# EasyEDA Pro project CALU_BMS_1_2_0_0.epro, board PCB5
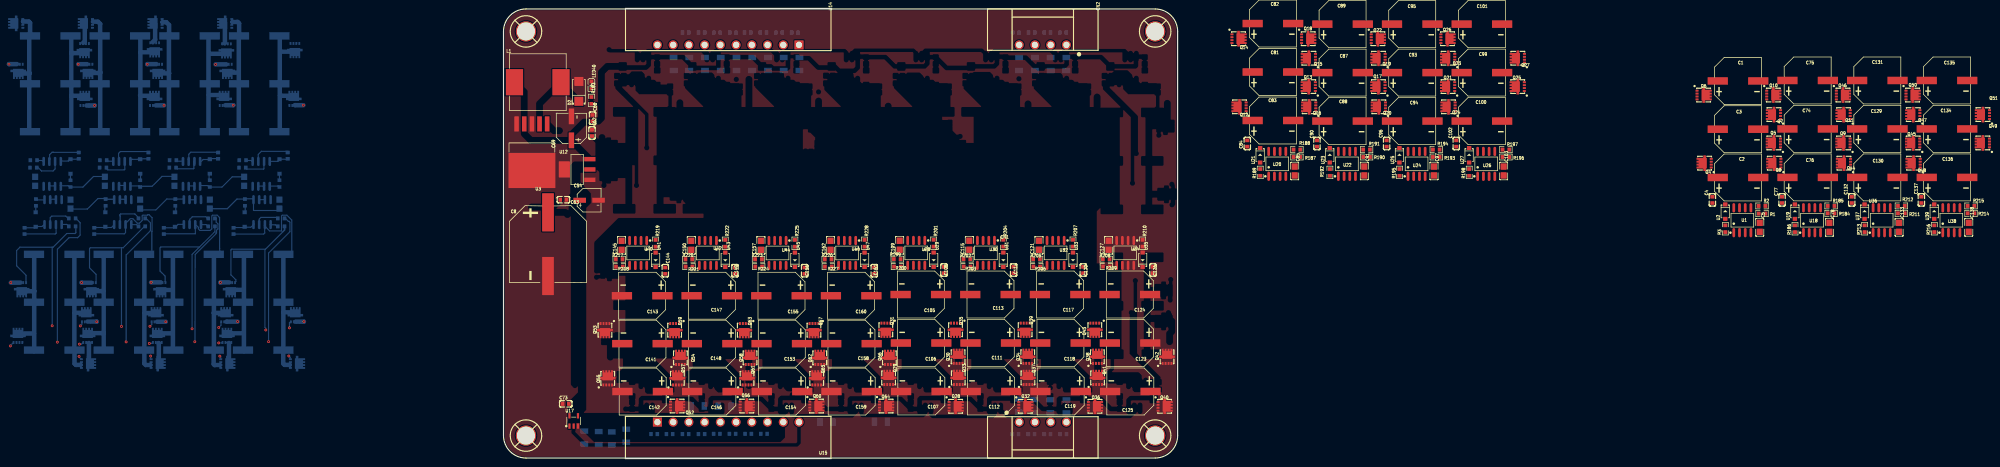
[diagram p12: board, top side]
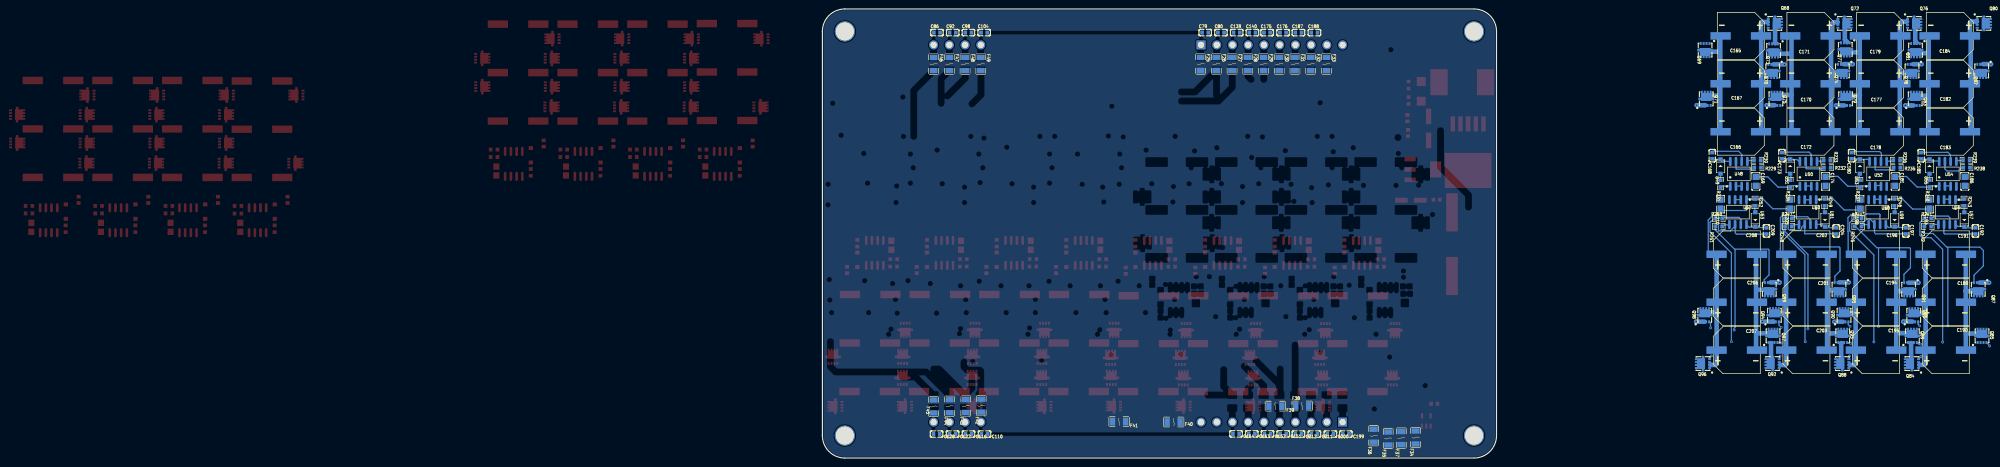
[diagram p13: board, bottom side, seen from below]

Outline 150 x 100 mm; copper layers: Top Layer, Inner1, Inner2, Bottom Layer. Coordinates in mm from the lower left corner of the outline.
Outline path: 0,95 0,5 arc(1.46,1.46) 5,0 145,0 arc(148.54,1.46) 150,5 150,95 arc(148.54,98.54) 145,100 5,100 arc(1.46,98.54) 0,95
Stack: Top Layer 0.035mm Outer layer thickness 1oz / Dielectric1 0.2104mm 7628 RC49% 8.6mil / Inner1 0.0152mm Inner layer thickness / Dielectric2 1.065mm 1.1mm H/HOZ Copper / Inner2 0.0152mm Inner layer thickness / Dielectric3 0.2104mm 7628 RC49% 8.6mil / Bottom Layer 0.035mm Outer layer thickness 1oz

## Design rules (mm)
template: Custom Config
spacing copperThickness1oz (default): track to track 0.102, other pairs 0.152 to 0.3
spacing copperThickness2oz: track to track 0.203, other pairs 0.152 to 0.3
track width copperThickness1oz (default): min 0.127, default 0.254, max 2.54
track width copperThickness2oz: min 0.203, default 0.254, max 2.54
differential pair differentialPair (default): width min 0.127, default 0.254, max 2.54; gap min 0.152, default 0.152
via viaSize (default): diameter min 0.5, default 0.61, max 10; hole min 0.3, default 0.305, max 6.3

## Placement (name value [footprint] x y rotation side)
C1  2200uF  [CAP-SMD_BD10.0-L10.3-W10.3-LS11.0-FD]  274.69 83.97 0 top
C2  2200uF  [CAP-SMD_BD10.0-L10.3-W10.3-LS11.0-FD]  274.69 62.48 0 top
C3  2200uF  [CAP-SMD_BD10.0-L10.3-W10.3-LS11.0-FD]  274.69 73.22 0 top
C4  470nF  [C0603]  268.99 57.49 90 top
C5  10uF  [C0805]  279.53 51.37 270 top
C8  470uF  [CAP-SMD_BD16.0-L17.0-W17.0-FD-LS18.0]  9.91 47.62 270 top
C54  22uF  [CAP-SMD_BD5.0-L5.3-W5.3-LS6.0-FD]  19.05 57.4 0 top
C62  100nF  [C0603]  19.69 72.39 270 top
C63  100nF  [C0603]  13.33 57.53 180 top
C68  100nF  [C0603]  19.81 75.69 270 top
C69  470uF  [CAP-SMD_BD6.3-L6.6-W6.6-LS7.6-RD]  15.11 73.41 90 top
C73  100nF  [C0603]  13.84 12.06 0 top
C74  2200uF  [CAP-SMD_BD10.0-L10.3-W10.3-LS11.0-FD]  290.19 73.28 0 top
C75  2200uF  [CAP-SMD_BD10.0-L10.3-W10.3-LS11.0-FD]  290.19 84.08 0 top
C76  2200uF  [CAP-SMD_BD10.0-L10.3-W10.3-LS11.0-FD]  290.19 62.49 0 top
C77  470nF  [C0603]  284.49 57.49 90 top
C78  10uF  [C0805]  295.03 51.37 270 top
C79  100nF  [C0603]  64.81 94.75 180 bottom
C80  100nF  [C0603]  61.31 94.75 180 bottom
C81  2200uF  [CAP-SMD_BD10.0-L10.3-W10.3-LS11.0-FD]  171.2 85.96 0 top
C82  2200uF  [CAP-SMD_BD10.0-L10.3-W10.3-LS11.0-FD]  171.2 96.75 0 top
C83  2200uF  [CAP-SMD_BD10.0-L10.3-W10.3-LS11.0-FD]  171.2 75.17 0 top
C84  470nF  [C0603]  165.5 70.04 90 top
C85  10uF  [C0805]  176.04 63.92 270 top
C86  100nF  [C0603]  124.5 94.75 180 bottom
C87  2200uF  [CAP-SMD_BD10.0-L10.3-W10.3-LS11.0-FD]  186.7 85.83 0 top
C88  2200uF  [CAP-SMD_BD10.0-L10.3-W10.3-LS11.0-FD]  186.7 75.04 0 top
C89  2200uF  [CAP-SMD_BD10.0-L10.3-W10.3-LS11.0-FD]  186.7 96.63 0 top
C90  470nF  [C0603]  181 70.04 90 top
C91  10uF  [C0805]  191.54 63.92 270 top
C92  100nF  [C0603]  121 94.75 180 bottom
C93  2200uF  [CAP-SMD_BD10.0-L10.3-W10.3-LS11.0-FD]  202.2 85.83 0 top
C94  2200uF  [CAP-SMD_BD10.0-L10.3-W10.3-LS11.0-FD]  202.2 75.04 0 top
C95  2200uF  [CAP-SMD_BD10.0-L10.3-W10.3-LS11.0-FD]  202.2 96.63 0 top
C96  470nF  [C0603]  196.5 70.04 90 top
C97  10uF  [C0805]  207.04 63.92 270 top
C98  100nF  [C0603]  117.5 94.75 180 bottom
C99  2200uF  [CAP-SMD_BD10.0-L10.3-W10.3-LS11.0-FD]  217.7 85.83 0 top
C100  2200uF  [CAP-SMD_BD10.0-L10.3-W10.3-LS11.0-FD]  217.7 75.04 0 top
C101  2200uF  [CAP-SMD_BD10.0-L10.3-W10.3-LS11.0-FD]  217.7 96.63 0 top
C102  470nF  [C0603]  212 70.04 90 top
C103  10uF  [C0805]  222.54 63.92 270 top
C104  100nF  [C0603]  114 94.75 180 bottom
C105  2200uF  [CAP-SMD_BD10.0-L10.3-W10.3-LS11.0-FD]  92.86 36.41 180 top
C106  2200uF  [CAP-SMD_BD10.0-L10.3-W10.3-LS11.0-FD]  92.92 25.61 180 top
C107  2200uF  [CAP-SMD_BD10.0-L10.3-W10.3-LS11.0-FD]  92.97 14.82 180 top
C108  470nF  [C0603]  98 41.87 270 top
C109  10uF  [C0805]  88.15 47.38 90 top
C110  100nF  [C0603]  113.92 5.33 0 bottom
C111  2200uF  [CAP-SMD_BD10.0-L10.3-W10.3-LS11.0-FD]  108.42 25.61 180 top
C112  2200uF  [CAP-SMD_BD10.0-L10.3-W10.3-LS11.0-FD]  108.47 14.82 180 top
C113  2200uF  [CAP-SMD_BD10.0-L10.3-W10.3-LS11.0-FD]  108.36 36.41 180 top
C114  470nF  [C0603]  113.5 41.87 270 top
C115  10uF  [C0805]  103.65 47.38 90 top
C116  100nF  [C0603]  117.47 5.33 0 bottom
C117  2200uF  [CAP-SMD_BD10.0-L10.3-W10.3-LS11.0-FD]  123.86 36.41 180 top
C118  2200uF  [CAP-SMD_BD10.0-L10.3-W10.3-LS11.0-FD]  123.92 25.61 180 top
C119  2200uF  [CAP-SMD_BD10.0-L10.3-W10.3-LS11.0-FD]  123.97 14.82 180 top
C120  470nF  [C0603]  129 41.87 270 top
C121  10uF  [C0805]  119.15 47.38 90 top
C122  100nF  [C0603]  121.03 5.33 0 bottom
C123  2200uF  [CAP-SMD_BD10.0-L10.3-W10.3-LS11.0-FD]  139.42 25.61 180 top
C124  2200uF  [CAP-SMD_BD10.0-L10.3-W10.3-LS11.0-FD]  139.36 36.41 180 top
C125  2200uF  [CAP-SMD_BD10.0-L10.3-W10.3-LS11.0-FD]  139.47 14.82 180 top
C126  470nF  [C0603]  144.5 41.87 270 top
C127  10uF  [C0805]  134.65 47.38 90 top
C128  100nF  [C0603]  124.59 5.33 0 bottom
C129  2200uF  [CAP-SMD_BD10.0-L10.3-W10.3-LS11.0-FD]  305.69 73.28 0 top
C130  2200uF  [CAP-SMD_BD10.0-L10.3-W10.3-LS11.0-FD]  305.69 62.49 0 top
C131  2200uF  [CAP-SMD_BD10.0-L10.3-W10.3-LS11.0-FD]  305.69 84.08 0 top
C132  470nF  [C0603]  299.99 57.49 90 top
C133  10uF  [C0805]  310.53 51.37 270 top
C134  2200uF  [CAP-SMD_BD10.0-L10.3-W10.3-LS11.0-FD]  321.19 73.28 0 top
C135  2200uF  [CAP-SMD_BD10.0-L10.3-W10.3-LS11.0-FD]  321.19 84.08 0 top
C136  2200uF  [CAP-SMD_BD10.0-L10.3-W10.3-LS11.0-FD]  321.19 62.49 0 top
C137  470nF  [C0603]  315.49 57.49 90 top
C138  10uF  [C0805]  326.03 51.37 270 top
C139  100nF  [C0603]  57.81 94.75 180 bottom
C140  100nF  [C0603]  54.31 94.75 180 bottom
C141  2200uF  [CAP-SMD_BD10.0-L10.3-W10.3-LS11.0-FD]  30.92 25.47 180 top
C142  2200uF  [CAP-SMD_BD10.0-L10.3-W10.3-LS11.0-FD]  30.97 14.8 180 top
C143  2200uF  [CAP-SMD_BD10.0-L10.3-W10.3-LS11.0-FD]  30.86 36.14 180 top
C144  470nF  [C0603]  36 41.72 270 top
C145  10uF  [C0805]  26.27 47.36 90 top
C146  2200uF  [CAP-SMD_BD10.0-L10.3-W10.3-LS11.0-FD]  46.47 14.8 180 top
C147  2200uF  [CAP-SMD_BD10.0-L10.3-W10.3-LS11.0-FD]  46.36 36.14 180 top
C148  2200uF  [CAP-SMD_BD10.0-L10.3-W10.3-LS11.0-FD]  46.42 25.47 180 top
C149  470nF  [C0603]  51.5 41.72 270 top
C150  10uF  [C0805]  41.77 47.36 90 top
C151  100nF  [C0603]  47.45 5.38 0 bottom
C152  100nF  [C0603]  50.95 5.38 0 bottom
C153  2200uF  [CAP-SMD_BD10.0-L10.3-W10.3-LS11.0-FD]  61.92 25.47 180 top
C154  2200uF  [CAP-SMD_BD10.0-L10.3-W10.3-LS11.0-FD]  61.97 14.8 180 top
C155  2200uF  [CAP-SMD_BD10.0-L10.3-W10.3-LS11.0-FD]  61.86 36.14 180 top
C156  470nF  [C0603]  67 41.72 270 top
C157  10uF  [C0805]  57.27 47.36 90 top
C158  2200uF  [CAP-SMD_BD10.0-L10.3-W10.3-LS11.0-FD]  77.42 25.47 180 top
C159  2200uF  [CAP-SMD_BD10.0-L10.3-W10.3-LS11.0-FD]  77.47 14.8 180 top
C160  2200uF  [CAP-SMD_BD10.0-L10.3-W10.3-LS11.0-FD]  77.36 36.14 180 top
C161  470nF  [C0603]  82.5 41.72 270 top
C162  10uF  [C0805]  72.77 47.36 90 top
C163  100nF  [C0603]  54.45 5.38 0 bottom
C164  100nF  [C0603]  57.95 5.38 0 bottom
C165  2200uF  [CAP-SMD_BD10.0-L10.3-W10.3-LS11.0-FD]  -54.36 94.01 0 bottom
C166  2200uF  [CAP-SMD_BD10.0-L10.3-W10.3-LS11.0-FD]  -54.36 72.67 0 bottom
C167  2200uF  [CAP-SMD_BD10.0-L10.3-W10.3-LS11.0-FD]  -54.36 83.34 0 bottom
C168  470nF  [C0603]  -48.01 67.34 90 bottom
C169  10uF  [C0805]  -57.71 61.62 270 bottom
C170  2200uF  [CAP-SMD_BD10.0-L10.3-W10.3-LS11.0-FD]  -69.86 83.34 0 bottom
C171  2200uF  [CAP-SMD_BD10.0-L10.3-W10.3-LS11.0-FD]  -69.86 94.01 0 bottom
C172  2200uF  [CAP-SMD_BD10.0-L10.3-W10.3-LS11.0-FD]  -69.86 72.67 0 bottom
C173  470nF  [C0603]  -63.51 67.34 90 bottom
C174  10uF  [C0805]  -73.21 61.62 270 bottom
C175  100nF  [C0603]  51.05 94.74 180 bottom
C176  100nF  [C0603]  47.5 94.74 180 bottom
C177  2200uF  [CAP-SMD_BD10.0-L10.3-W10.3-LS11.0-FD]  -85.36 83.34 0 bottom
C178  2200uF  [CAP-SMD_BD10.0-L10.3-W10.3-LS11.0-FD]  -85.36 72.67 0 bottom
C179  2200uF  [CAP-SMD_BD10.0-L10.3-W10.3-LS11.0-FD]  -85.36 94.01 0 bottom
C180  470nF  [C0603]  -79.01 67.34 90 bottom
C181  10uF  [C0805]  -88.71 61.62 270 bottom
C182  2200uF  [CAP-SMD_BD10.0-L10.3-W10.3-LS11.0-FD]  -100.86 83.34 0 bottom
C183  2200uF  [CAP-SMD_BD10.0-L10.3-W10.3-LS11.0-FD]  -100.86 72.67 0 bottom
C184  2200uF  [CAP-SMD_BD10.0-L10.3-W10.3-LS11.0-FD]  -100.86 94.01 0 bottom
C185  470nF  [C0603]  -94.51 67.34 90 bottom
C186  10uF  [C0805]  -104.21 61.62 270 bottom
C187  100nF  [C0603]  44.07 94.74 180 bottom
C188  100nF  [C0603]  40.51 94.74 180 bottom
C189  2200uF  [CAP-SMD_BD10.0-L10.3-W10.3-LS11.0-FD]  -99.97 34.7 180 bottom
C190  2200uF  [CAP-SMD_BD10.0-L10.3-W10.3-LS11.0-FD]  -99.97 24.03 180 bottom
C191  2200uF  [CAP-SMD_BD10.0-L10.3-W10.3-LS11.0-FD]  -99.97 45.37 180 bottom
C192  470nF  [C0603]  -106.57 50.57 270 bottom
C193  10uF  [C0805]  -96.35 56.54 90 bottom
C194  2200uF  [CAP-SMD_BD10.0-L10.3-W10.3-LS11.0-FD]  -84.47 34.7 180 bottom
C195  2200uF  [CAP-SMD_BD10.0-L10.3-W10.3-LS11.0-FD]  -84.47 24.03 180 bottom
C196  2200uF  [CAP-SMD_BD10.0-L10.3-W10.3-LS11.0-FD]  -84.47 45.37 180 bottom
C197  470nF  [C0603]  -91.07 50.57 270 bottom
C198  10uF  [C0805]  -80.85 56.54 90 bottom
C199  100nF  [C0603]  33.53 5.33 0 bottom
C200  100nF  [C0603]  36.96 5.33 0 bottom
C201  2200uF  [CAP-SMD_BD10.0-L10.3-W10.3-LS11.0-FD]  -68.97 34.7 180 bottom
C202  2200uF  [CAP-SMD_BD10.0-L10.3-W10.3-LS11.0-FD]  -68.97 45.37 180 bottom
C203  2200uF  [CAP-SMD_BD10.0-L10.3-W10.3-LS11.0-FD]  -68.97 24.03 180 bottom
C204  470nF  [C0603]  -75.57 50.57 270 bottom
C205  10uF  [C0805]  -65.35 56.54 90 bottom
C206  2200uF  [CAP-SMD_BD10.0-L10.3-W10.3-LS11.0-FD]  -53.47 34.7 180 bottom
C207  2200uF  [CAP-SMD_BD10.0-L10.3-W10.3-LS11.0-FD]  -53.47 24.03 180 bottom
C208  2200uF  [CAP-SMD_BD10.0-L10.3-W10.3-LS11.0-FD]  -53.47 45.37 180 bottom
C209  470nF  [C0603]  -60.07 50.57 270 bottom
C210  10uF  [C0805]  -49.85 56.54 90 bottom
C211  100nF  [C0603]  40.51 5.33 0 bottom
C212  100nF  [C0603]  44.07 5.33 0 bottom
CN1  BATT_NEXT  [CONN-TH_4P-P3.50_MAX_MX15EDGRM-3.5-04P-GN01-CU-A]  120 8 0 top
CN2  BATT_PREV  [CONN-TH_4P-P3.50_MAX_MX15EDGRM-3.5-04P-GN01-CU-A]  120 92 180 top
D2  SS34  [SMA_L4.3-W2.6-LS5.2-RD]  16.76 81.66 90 top
F25  SMD1206P005TF  [F1206]  65.84 87.75 270 bottom
F26  SMD1206P005TF  [F1206]  62.34 87.75 270 bottom
F27  SMD1206P005TF  [F1206]  58.84 87.75 270 bottom
F28  SMD1206P005TF  [F1206]  55.34 87.75 270 bottom
F29  SMD1206P005TF  [F1206]  51.84 87.75 270 bottom
F30  SMD1206P005TF  [F1206]  48.34 87.75 270 bottom
F31  SMD1206P005TF  [F1206]  44.84 87.75 270 bottom
F32  SMD1206P005TF  [F1206]  41.34 87.75 270 bottom
F33  SMD1206P005TF  [F1206]  37.84 87.75 270 bottom
F34  SMD1206P005TF  [F1206]  17.99 4.56 90 bottom
F35  SMD1206P005TF  [F1206]  24.1 4.36 90 bottom
F36  SMD1206P005TF  [F1206]  27.31 4.97 90 bottom
F37  SMD1206P005TF  [F1206]  21.19 4.44 90 bottom
F38  SMD1206P005TF  [F1206]  43.23 11.59 180 bottom
F39  SMD1206P005TF  [F1206]  49.2 11.55 0 bottom
F40  SMD1206P005TF  [F1206]  71.83 8.02 0 bottom
F41  SMD1206P005TF  [F1206]  83.98 8.1 0 bottom
F42  SMD1206P005TF  [F1206]  114.66 11.66 90 bottom
F43  SMD1206P005TF  [F1206]  118.09 11.58 90 bottom
F44  SMD1206P005TF  [F1206]  121.69 11.54 90 bottom
F45  SMD1206P005TF  [F1206]  125.26 11.48 90 bottom
F46  SMD1206P005TF  [F1206]  125.24 87.74 270 bottom
F47  SMD1206P005TF  [F1206]  121.74 87.74 270 bottom
F48  SMD1206P005TF  [F1206]  118.24 87.74 270 bottom
F49  SMD1206P005TF  [F1206]  114.74 87.74 270 bottom
L1  68uH  [IND-SMD_L12.5-W12.5]  7.62 83.69 0 top
LED40  LED_PWR  [LED0603-RD-YELLOW]  19.56 83.06 270 top
Q4  40N06D  [WDFN-5_L3.1-W3.1-P0.65-BL_1]  268 65.66 90 top
Q5  40N06D  [WDFN-5_L3.1-W3.1-P0.65-BL_1]  283.4 70.17 90 top
Q6  40N06D  [WDFN-5_L3.1-W3.1-P0.65-BL_1]  266.31 80.83 270 top
Q7  40N06D  [WDFN-5_L3.1-W3.1-P0.65-BL_1]  283.42 76.48 90 top
Q8  40N06D  [WDFN-5_L3.1-W3.1-P0.65-BL_1]  283.5 65.66 90 top
Q9  40N06D  [WDFN-5_L3.1-W3.1-P0.65-BL_1]  298.9 70.17 90 top
Q10  40N06D  [WDFN-5_L3.1-W3.1-P0.65-BL_1]  281.81 80.83 270 top
Q11  40N06D  [WDFN-5_L3.1-W3.1-P0.65-BL_1]  298.92 76.48 90 top
Q12  40N06D  [WDFN-5_L3.1-W3.1-P0.65-BL_1]  164.51 78.21 90 top
Q13  40N06D  [WDFN-5_L3.1-W3.1-P0.65-BL_1]  179.91 82.71 90 top
Q14  40N06D  [WDFN-5_L3.1-W3.1-P0.65-BL_1]  162.82 93.38 270 top
Q15  40N06D  [WDFN-5_L3.1-W3.1-P0.65-BL_1]  179.93 89.03 90 top
Q16  40N06D  [WDFN-5_L3.1-W3.1-P0.65-BL_1]  180.01 78.21 90 top
Q17  40N06D  [WDFN-5_L3.1-W3.1-P0.65-BL_1]  195.41 82.71 90 top
Q18  40N06D  [WDFN-5_L3.1-W3.1-P0.65-BL_1]  178.32 93.38 270 top
Q19  40N06D  [WDFN-5_L3.1-W3.1-P0.65-BL_1]  195.43 89.03 90 top
Q20  40N06D  [WDFN-5_L3.1-W3.1-P0.65-BL_1]  195.51 78.21 90 top
Q21  40N06D  [WDFN-5_L3.1-W3.1-P0.65-BL_1]  210.91 82.71 90 top
Q22  40N06D  [WDFN-5_L3.1-W3.1-P0.65-BL_1]  193.82 93.38 270 top
Q23  40N06D  [WDFN-5_L3.1-W3.1-P0.65-BL_1]  210.93 89.03 90 top
Q24  40N06D  [WDFN-5_L3.1-W3.1-P0.65-BL_1]  211.01 78.21 90 top
Q25  40N06D  [WDFN-5_L3.1-W3.1-P0.65-BL_1]  226.41 82.71 90 top
Q26  40N06D  [WDFN-5_L3.1-W3.1-P0.65-BL_1]  209.32 93.38 270 top
Q27  40N06D  [WDFN-5_L3.1-W3.1-P0.65-BL_1]  226.43 89.03 90 top
Q28  40N06D  [WDFN-5_L3.1-W3.1-P0.65-BL_1]  99.88 11.52 270 top
Q29  40N06D  [WDFN-5_L3.1-W3.1-P0.65-BL_1]  85.69 17.11 0 top
Q30  40N06D  [WDFN-5_L3.1-W3.1-P0.65-BL_1]  101.14 21.81 0 top
Q31  40N06D  [WDFN-5_L3.1-W3.1-P0.65-BL_1]  85.07 29.3 180 top
Q32  40N06D  [WDFN-5_L3.1-W3.1-P0.65-BL_1]  115.38 11.52 270 top
Q33  40N06D  [WDFN-5_L3.1-W3.1-P0.65-BL_1]  101.19 17.11 0 top
Q34  40N06D  [WDFN-5_L3.1-W3.1-P0.65-BL_1]  116.64 21.81 0 top
Q35  40N06D  [WDFN-5_L3.1-W3.1-P0.65-BL_1]  100.57 29.3 180 top
Q36  40N06D  [WDFN-5_L3.1-W3.1-P0.65-BL_1]  130.88 11.52 270 top
Q37  40N06D  [WDFN-5_L3.1-W3.1-P0.65-BL_1]  116.69 17.11 0 top
Q38  40N06D  [WDFN-5_L3.1-W3.1-P0.65-BL_1]  132.14 21.81 0 top
Q39  40N06D  [WDFN-5_L3.1-W3.1-P0.65-BL_1]  116.07 29.3 180 top
Q40  40N06D  [WDFN-5_L3.1-W3.1-P0.65-BL_1]  146.38 11.52 270 top
Q41  40N06D  [WDFN-5_L3.1-W3.1-P0.65-BL_1]  132.19 17.11 0 top
Q42  40N06D  [WDFN-5_L3.1-W3.1-P0.65-BL_1]  147.64 21.81 0 top
Q43  40N06D  [WDFN-5_L3.1-W3.1-P0.65-BL_1]  131.57 29.3 180 top
Q44  40N06D  [WDFN-5_L3.1-W3.1-P0.65-BL_1]  299 65.66 90 top
Q45  40N06D  [WDFN-5_L3.1-W3.1-P0.65-BL_1]  314.4 70.17 90 top
Q46  40N06D  [WDFN-5_L3.1-W3.1-P0.65-BL_1]  297.31 80.83 270 top
Q47  40N06D  [WDFN-5_L3.1-W3.1-P0.65-BL_1]  314.42 76.48 90 top
Q48  40N06D  [WDFN-5_L3.1-W3.1-P0.65-BL_1]  314.5 65.66 90 top
Q49  40N06D  [WDFN-5_L3.1-W3.1-P0.65-BL_1]  329.9 70.17 90 top
Q50  40N06D  [WDFN-5_L3.1-W3.1-P0.65-BL_1]  312.81 80.83 270 top
Q51  40N06D  [WDFN-5_L3.1-W3.1-P0.65-BL_1]  329.92 76.48 90 top
Q52  40N06D  [WDFN-5_L3.1-W3.1-P0.65-BL_1]  37.89 11.57 270 top
Q53  40N06D  [WDFN-5_L3.1-W3.1-P0.65-BL_1]  22.58 29.21 180 top
Q54  40N06D  [WDFN-5_L3.1-W3.1-P0.65-BL_1]  39.36 21.57 0 top
Q55  40N06D  [WDFN-5_L3.1-W3.1-P0.65-BL_1]  23.19 17.02 0 top
Q56  40N06D  [WDFN-5_L3.1-W3.1-P0.65-BL_1]  53.39 11.57 270 top
Q57  40N06D  [WDFN-5_L3.1-W3.1-P0.65-BL_1]  38.69 17.02 0 top
Q58  40N06D  [WDFN-5_L3.1-W3.1-P0.65-BL_1]  54.86 21.57 0 top
Q59  40N06D  [WDFN-5_L3.1-W3.1-P0.65-BL_1]  38.08 29.21 180 top
Q60  40N06D  [WDFN-5_L3.1-W3.1-P0.65-BL_1]  68.89 11.57 270 top
Q61  40N06D  [WDFN-5_L3.1-W3.1-P0.65-BL_1]  54.19 17.02 0 top
Q62  40N06D  [WDFN-5_L3.1-W3.1-P0.65-BL_1]  70.36 21.57 0 top
Q63  40N06D  [WDFN-5_L3.1-W3.1-P0.65-BL_1]  53.58 29.21 180 top
Q64  40N06D  [WDFN-5_L3.1-W3.1-P0.65-BL_1]  84.39 11.57 270 top
Q65  40N06D  [WDFN-5_L3.1-W3.1-P0.65-BL_1]  69.69 17.02 0 top
Q66  40N06D  [WDFN-5_L3.1-W3.1-P0.65-BL_1]  85.86 21.57 0 top
Q67  40N06D  [WDFN-5_L3.1-W3.1-P0.65-BL_1]  69.07 29.21 180 top
Q68  40N06D  [WDFN-5_L3.1-W3.1-P0.65-BL_1]  -61.2 96.79 270 bottom
Q69  40N06D  [WDFN-5_L3.1-W3.1-P0.65-BL_1]  -46.42 91.59 0 bottom
Q70  40N06D  [WDFN-5_L3.1-W3.1-P0.65-BL_1]  -61.46 86.94 0 bottom
Q71  40N06D  [WDFN-5_L3.1-W3.1-P0.65-BL_1]  -46.67 79.24 180 bottom
Q72  40N06D  [WDFN-5_L3.1-W3.1-P0.65-BL_1]  -76.7 96.79 270 bottom
Q73  40N06D  [WDFN-5_L3.1-W3.1-P0.65-BL_1]  -61.65 91.51 0 bottom
Q74  40N06D  [WDFN-5_L3.1-W3.1-P0.65-BL_1]  -76.96 86.94 0 bottom
Q75  40N06D  [WDFN-5_L3.1-W3.1-P0.65-BL_1]  -62.17 79.24 180 bottom
Q76  40N06D  [WDFN-5_L3.1-W3.1-P0.65-BL_1]  -92.2 96.79 270 bottom
Q77  40N06D  [WDFN-5_L3.1-W3.1-P0.65-BL_1]  -77.62 91.74 0 bottom
Q78  40N06D  [WDFN-5_L3.1-W3.1-P0.65-BL_1]  -92.46 86.94 0 bottom
Q79  40N06D  [WDFN-5_L3.1-W3.1-P0.65-BL_1]  -77.67 79.24 180 bottom
Q80  40N06D  [WDFN-5_L3.1-W3.1-P0.65-BL_1]  -107.7 96.79 270 bottom
Q81  40N06D  [WDFN-5_L3.1-W3.1-P0.65-BL_1]  -93.23 91.56 0 bottom
Q82  40N06D  [WDFN-5_L3.1-W3.1-P0.65-BL_1]  -107.96 86.94 0 bottom
Q83  40N06D  [WDFN-5_L3.1-W3.1-P0.65-BL_1]  -93.17 79.24 180 bottom
Q84  40N06D  [WDFN-5_L3.1-W3.1-P0.65-BL_1]  -93.18 21.03 90 bottom
Q85  40N06D  [WDFN-5_L3.1-W3.1-P0.65-BL_1]  -108.04 26.47 180 bottom
Q86  40N06D  [WDFN-5_L3.1-W3.1-P0.65-BL_1]  -92.83 31.06 180 bottom
Q87  40N06D  [WDFN-5_L3.1-W3.1-P0.65-BL_1]  -107.2 38.32 0 bottom
Q88  40N06D  [WDFN-5_L3.1-W3.1-P0.65-BL_1]  -77.68 21.03 90 bottom
Q89  40N06D  [WDFN-5_L3.1-W3.1-P0.65-BL_1]  -92.54 26.47 180 bottom
Q90  40N06D  [WDFN-5_L3.1-W3.1-P0.65-BL_1]  -77.33 31.06 180 bottom
Q91  40N06D  [WDFN-5_L3.1-W3.1-P0.65-BL_1]  -91.7 38.32 0 bottom
Q92  40N06D  [WDFN-5_L3.1-W3.1-P0.65-BL_1]  -62.18 21.03 90 bottom
Q93  40N06D  [WDFN-5_L3.1-W3.1-P0.65-BL_1]  -77.04 26.47 180 bottom
Q94  40N06D  [WDFN-5_L3.1-W3.1-P0.65-BL_1]  -61.83 31.06 180 bottom
Q95  40N06D  [WDFN-5_L3.1-W3.1-P0.65-BL_1]  -76.2 38.32 0 bottom
Q96  40N06D  [WDFN-5_L3.1-W3.1-P0.65-BL_1]  -46.68 21.03 90 bottom
Q97  40N06D  [WDFN-5_L3.1-W3.1-P0.65-BL_1]  -61.54 26.47 180 bottom
Q98  40N06D  [WDFN-5_L3.1-W3.1-P0.65-BL_1]  -46.33 31.06 180 bottom
Q99  40N06D  [WDFN-5_L3.1-W3.1-P0.65-BL_1]  -60.7 38.32 0 bottom
R1  4.7Ω  [R0603]  280.04 54.44 0 top
R2  4.7Ω  [R0603]  280.04 56.14 0 top
R3  4.7Ω  [R0603]  271.87 51.06 90 top
R183  4.7kΩ  [R0603]  19.56 79.63 270 top
R184  4.7Ω  [R0603]  295.4 54.49 0 top
R185  4.7Ω  [R0603]  295.4 56.14 0 top
R186  4.7Ω  [R0603]  287.37 51.06 90 top
R187  4.7Ω  [R0603]  176.55 67.04 0 top
R188  4.7Ω  [R0603]  176.55 68.69 0 top
R189  4.7Ω  [R0603]  168.38 63.61 90 top
R190  4.7Ω  [R0603]  192.05 67.04 0 top
R191  4.7Ω  [R0603]  192.05 68.69 0 top
R192  4.7Ω  [R0603]  183.88 63.61 90 top
R193  4.7Ω  [R0603]  207.55 67.04 0 top
R194  4.7Ω  [R0603]  207.55 68.69 0 top
R195  4.7Ω  [R0603]  199.38 63.61 90 top
R196  4.7Ω  [R0603]  223.05 67.04 0 top
R197  4.7Ω  [R0603]  223.05 68.69 0 top
R198  4.7Ω  [R0603]  214.88 63.61 90 top
R199  4.7Ω  [R0603]  87.61 44.28 180 top
R200  4.7Ω  [R0603]  87.65 42.63 180 top
R201  4.7Ω  [R0603]  95.72 47.84 270 top
R202  4.7Ω  [R0603]  103.11 44.28 180 top
R203  4.7Ω  [R0603]  103.15 42.63 180 top
R204  4.7Ω  [R0603]  111.22 47.84 270 top
R205  4.7Ω  [R0603]  118.61 44.28 180 top
R206  4.7Ω  [R0603]  118.65 42.63 180 top
R207  4.7Ω  [R0603]  126.72 47.84 270 top
R208  4.7Ω  [R0603]  134.11 44.28 180 top
R209  4.7Ω  [R0603]  134.15 42.63 180 top
R210  4.7Ω  [R0603]  142.22 47.84 270 top
R211  4.7Ω  [R0603]  311.04 54.49 0 top
R212  4.7Ω  [R0603]  311.04 56.14 0 top
R213  4.7Ω  [R0603]  302.87 51.06 90 top
R214  4.7Ω  [R0603]  326.54 54.49 0 top
R215  4.7Ω  [R0603]  326.54 56.14 0 top
R216  4.7Ω  [R0603]  318.37 51.06 90 top
R217  4.7Ω  [R0603]  25.74 44.27 180 top
R218  4.7Ω  [R0603]  25.78 42.61 180 top
R219  4.7Ω  [R0603]  33.84 47.82 270 top
R220  4.7Ω  [R0603]  41.24 44.27 180 top
R221  4.7Ω  [R0603]  41.28 42.61 180 top
R222  4.7Ω  [R0603]  49.34 47.82 270 top
R223  4.7Ω  [R0603]  56.74 44.27 180 top
R224  4.7Ω  [R0603]  56.78 42.61 180 top
R225  4.7Ω  [R0603]  64.84 47.82 270 top
R226  4.7Ω  [R0603]  72.24 44.27 180 top
R227  4.7Ω  [R0603]  72.28 42.61 180 top
R228  4.7Ω  [R0603]  80.34 47.82 270 top
R229  4.7Ω  [R0603]  -58.11 64.67 180 bottom
R230  4.7Ω  [R0603]  -58.04 66.32 180 bottom
R231  4.7Ω  [R0603]  -49.85 61.11 90 bottom
R232  4.7Ω  [R0603]  -73.61 64.67 180 bottom
R233  4.7Ω  [R0603]  -73.54 66.32 180 bottom
R234  4.7Ω  [R0603]  -65.35 61.11 90 bottom
R235  4.7Ω  [R0603]  -89.11 64.67 180 bottom
R236  4.7Ω  [R0603]  -89.04 66.32 180 bottom
R237  4.7Ω  [R0603]  -80.85 61.11 90 bottom
R238  4.7Ω  [R0603]  -104.61 64.67 180 bottom
R239  4.7Ω  [R0603]  -104.54 66.32 180 bottom
R240  4.7Ω  [R0603]  -96.35 61.11 90 bottom
R241  4.7Ω  [R0603]  -95.97 53.37 0 bottom
R242  4.7Ω  [R0603]  -95.97 51.59 0 bottom
R243  4.7Ω  [R0603]  -104.03 56.92 270 bottom
R244  4.7Ω  [R0603]  -80.47 53.37 0 bottom
R245  4.7Ω  [R0603]  -80.47 51.59 0 bottom
R246  4.7Ω  [R0603]  -88.53 56.92 270 bottom
R247  4.7Ω  [R0603]  -64.97 53.37 0 bottom
R248  4.7Ω  [R0603]  -64.97 51.59 0 bottom
R249  4.7Ω  [R0603]  -73.03 56.92 270 bottom
R250  4.7Ω  [R0603]  -49.47 53.37 0 bottom
R251  4.7Ω  [R0603]  -49.47 51.59 0 bottom
R252  4.7Ω  [R0603]  -57.53 56.92 270 bottom
SCREW1  -  [Screw-Hole-M4]  5 95 0 top
SCREW2  -  [Screw-Hole-M4]  5 5 0 top
SCREW3  -  [Screw-Hole-M4]  145 5 0 top
SCREW4  -  [Screw-Hole-M4]  145 95 0 top
U1  XJNG2103  [SOIC-8_L4.9-W3.9-P1.27-LS6.0-BL]  275.66 52.96 0 top
U2  1N5819W  [SOD-123_L2.7-W1.6-LS3.7-FD]  271.85 54.87 90 top
U3  LM2596HVS-12/TR  [TO-263-5_L10.6-W9.6-P1.70-LS15.9-BR]  6.32 69.22 90 top
U12  AMS1117-3.3  [SOT-223-4_L6.5-W3.5-P2.30-LS7.0-BR]  16.38 64.26 0 top
U14  BATT_0  [CONN-TH_10P-P3.50_MX15EDGRM-3.5-10P-GN01-CU-A]  50 92 180 top
U15  BATT_1  [CONN-TH_10P-P3.50_MX15EDGRM-3.5-10P-GN01-CU-A]  50 8 0 top
U17  SN74LVC1G125DBVR  [SOT-23-5_L3.0-W1.7-P0.95-LS2.8-BL]  15.62 8.25 0 top
U18  XJNG2103  [SOIC-8_L4.9-W3.9-P1.27-LS6.0-BL]  291.16 52.96 0 top
U19  1N5819W  [SOD-123_L2.7-W1.6-LS3.7-FD]  287.35 54.87 90 top
U20  XJNG2103  [SOIC-8_L4.9-W3.9-P1.27-LS6.0-BL]  172.17 65.5 0 top
U21  1N5819W  [SOD-123_L2.7-W1.6-LS3.7-FD]  168.36 67.42 90 top
U22  XJNG2103  [SOIC-8_L4.9-W3.9-P1.27-LS6.0-BL]  187.67 65.5 0 top
U23  1N5819W  [SOD-123_L2.7-W1.6-LS3.7-FD]  183.86 67.42 90 top
U24  XJNG2103  [SOIC-8_L4.9-W3.9-P1.27-LS6.0-BL]  203.17 65.5 0 top
U25  1N5819W  [SOD-123_L2.7-W1.6-LS3.7-FD]  199.36 67.42 90 top
U26  XJNG2103  [SOIC-8_L4.9-W3.9-P1.27-LS6.0-BL]  218.67 65.5 0 top
U27  1N5819W  [SOD-123_L2.7-W1.6-LS3.7-FD]  214.86 67.42 90 top
U28  XJNG2103  [SOIC-8_L4.9-W3.9-P1.27-LS6.0-BL]  91.84 45.68 180 top
U29  1N5819W  [SOD-123_L2.7-W1.6-LS3.7-FD]  95.72 44.15 270 top
U30  XJNG2103  [SOIC-8_L4.9-W3.9-P1.27-LS6.0-BL]  107.34 45.68 180 top
U31  1N5819W  [SOD-123_L2.7-W1.6-LS3.7-FD]  111.22 44.15 270 top
U32  XJNG2103  [SOIC-8_L4.9-W3.9-P1.27-LS6.0-BL]  122.84 45.68 180 top
U33  1N5819W  [SOD-123_L2.7-W1.6-LS3.7-FD]  126.72 44.15 270 top
U34  XJNG2103  [SOIC-8_L4.9-W3.9-P1.27-LS6.0-BL]  138.34 45.68 180 top
U35  1N5819W  [SOD-123_L2.7-W1.6-LS3.7-FD]  142.22 44.15 270 top
U36  XJNG2103  [SOIC-8_L4.9-W3.9-P1.27-LS6.0-BL]  306.66 52.96 0 top
U37  1N5819W  [SOD-123_L2.7-W1.6-LS3.7-FD]  302.85 54.87 90 top
U38  XJNG2103  [SOIC-8_L4.9-W3.9-P1.27-LS6.0-BL]  322.16 52.96 0 top
U39  1N5819W  [SOD-123_L2.7-W1.6-LS3.7-FD]  318.35 54.87 90 top
U40  XJNG2103  [SOIC-8_L4.9-W3.9-P1.27-LS6.0-BL]  29.97 45.66 180 top
U41  1N5819W  [SOD-123_L2.7-W1.6-LS3.7-FD]  33.84 44.14 270 top
U42  XJNG2103  [SOIC-8_L4.9-W3.9-P1.27-LS6.0-BL]  45.47 45.66 180 top
U43  1N5819W  [SOD-123_L2.7-W1.6-LS3.7-FD]  49.34 44.14 270 top
U44  XJNG2103  [SOIC-8_L4.9-W3.9-P1.27-LS6.0-BL]  60.97 45.66 180 top
U45  1N5819W  [SOD-123_L2.7-W1.6-LS3.7-FD]  64.84 44.14 270 top
U46  XJNG2103  [SOIC-8_L4.9-W3.9-P1.27-LS6.0-BL]  76.47 45.66 180 top
U47  1N5819W  [SOD-123_L2.7-W1.6-LS3.7-FD]  80.34 44.14 270 top
U48  XJNG2103  [SOIC-8_L4.9-W3.9-P1.27-LS6.0-BL]  -53.92 63.27 180 bottom
U49  1N5819W  [SOD-123_L2.7-W1.6-LS3.7-FD]  -49.85 64.92 90 bottom
U50  XJNG2103  [SOIC-8_L4.9-W3.9-P1.27-LS6.0-BL]  -69.42 63.27 180 bottom
U51  1N5819W  [SOD-123_L2.7-W1.6-LS3.7-FD]  -65.35 64.92 90 bottom
U52  XJNG2103  [SOIC-8_L4.9-W3.9-P1.27-LS6.0-BL]  -84.92 63.27 180 bottom
U53  1N5819W  [SOD-123_L2.7-W1.6-LS3.7-FD]  -80.85 64.92 90 bottom
U54  XJNG2103  [SOIC-8_L4.9-W3.9-P1.27-LS6.0-BL]  -100.42 63.27 180 bottom
U55  1N5819W  [SOD-123_L2.7-W1.6-LS3.7-FD]  -96.35 64.92 90 bottom
U56  XJNG2103  [SOIC-8_L4.9-W3.9-P1.27-LS6.0-BL]  -100.22 54.76 0 bottom
U57  1N5819W  [SOD-123_L2.7-W1.6-LS3.7-FD]  -104.1 53.11 270 bottom
U58  XJNG2103  [SOIC-8_L4.9-W3.9-P1.27-LS6.0-BL]  -84.72 54.76 0 bottom
U59  1N5819W  [SOD-123_L2.7-W1.6-LS3.7-FD]  -88.6 53.11 270 bottom
U60  XJNG2103  [SOIC-8_L4.9-W3.9-P1.27-LS6.0-BL]  -69.22 54.76 0 bottom
U61  1N5819W  [SOD-123_L2.7-W1.6-LS3.7-FD]  -73.1 53.11 270 bottom
U62  XJNG2103  [SOIC-8_L4.9-W3.9-P1.27-LS6.0-BL]  -53.72 54.76 0 bottom
U63  1N5819W  [SOD-123_L2.7-W1.6-LS3.7-FD]  -57.6 53.11 270 bottom

## Footprints (pads in the part's own frame, mm; a bottom-side part is the same pattern mirrored in y, then rotated)
C0603
  rect 0.8x0.9 smd: 1(-0.7,0) 2(0.7,0)
C0805
  rect 1.41x1.35 smd: 1(-1,0) 2(1,0)
CAP-SMD_BD5.0-L5.3-W5.3-LS6.0-FD
  rect 2.8x1.1 smd: 1(-2.1,0) 2(2.1,0)
CAP-SMD_BD6.3-L6.6-W6.6-LS7.6-RD
  rect 3.5x1.2 smd: 1(-2.67,0) 2(2.67,0)
CAP-SMD_BD10.0-L10.3-W10.3-LS11.0-FD
  rect 4.5x1.65 smd: 1(-4.5,0) 2(4.5,0)
CAP-SMD_BD16.0-L17.0-W17.0-FD-LS18.0
  rect 8.5x2.6 smd: 1(-7.093,0) 2(7.093,0)
CONN-TH_4P-P3.50_MAX_MX15EDGRM-3.5-04P-GN01-CU-A
  round 2 hole 1.4: 1(-5.25,0) 2(-1.75,0) 3(1.75,0) 4(5.25,0)
CONN-TH_10P-P3.50_MX15EDGRM-3.5-10P-GN01-CU-A
  rect 2x2 hole 1.4: 1(-15.75,0.001)
  round 2 hole 1.4: 2(-12.25,-0.001) 3(-8.75,-0.001) 4(-5.25,-0.001) 5(-1.75,-0.001) 6(1.75,-0.001) 7(5.25,-0.001) 8(8.75,-0.001) 9(12.25,-0.001) 10(15.75,-0.001)
F1206
  rect 1.19x1.728 smd: 1(-1.445,0) 2(1.445,0)
IND-SMD_L12.5-W12.5
  rect 3.824x5.82 smd: 1(5.178,0) 2(-5.178,0)
LED0603-RD-YELLOW
  rect 0.8x0.8 smd: 1(-0.799,-0.004) 2(0.799,0.004)
R0603
  rect 0.806x0.864 smd: 1(-0.753,0) 2(0.753,0)
Screw-Hole-M4
  round 4.5 hole 4: 1(0,0)
SMA_L4.3-W2.6-LS5.2-RD
  rect 2x2 smd: 1(-2.2,0) 2(2.2,0)
SOD-123_L2.7-W1.6-LS3.7-FD
  rect 0.88x0.96 smd: 1(-1.61,0) 2(1.61,0)
SOIC-8_L4.9-W3.9-P1.27-LS6.0-BL
  oval 0.588x2.045 smd: 1(-1.905,-2.772) 2(-0.635,-2.772) 3(0.635,-2.772) 4(1.905,-2.772) 5(1.905,2.772) 6(0.635,2.772) 7(-0.635,2.772) 8(-1.905,2.772)
SOT-23-5_L3.0-W1.7-P0.95-LS2.8-BL
  rect 0.49x1.157 smd: 1(-0.95,-1.153) 2(0,-1.153) 3(0.95,-1.153)
  rect 0.49x1.175 smd: 4(0.95,1.153) 5(-0.95,1.153)
SOT-223-4_L6.5-W3.5-P2.30-LS7.0-BR
  rect 2.47x0.98 smd: 1(2.835,-2.3) 2(2.835,0) 3(2.835,2.3)
  rect 2.47x3.6 smd: 4(-2.835,0)
TO-263-5_L10.6-W9.6-P1.70-LS15.9-BR
  rect 3.358x1.02 smd: 1(5.184,-3.4) 2(5.184,-1.7) 3(5.184,0) 4(5.184,1.7) 5(5.184,3.4)
  rect 7.83x10.431 smd: 6(-5.184,0)
WDFN-5_L3.1-W3.1-P0.65-BL_1
  rect 0.42x0.66 smd: 1(-0.975,-0.735) 2(-0.325,-0.735) 3(0.325,-0.735) 4(0.975,-0.735)
  custom 3.48x2.265 smd: 5(0,0.735)

## Nets
As in the schematic, except:
GND: C5.2 C8.2 C54.2 C62.1 C63.1 C68.1 C69.2 C73.1 C78.2 C85.2 C91.2 C97.2 C103.2 C109.2 C115.2 C121.2 C127.2 C133.2 C138.2 C145.2 C150.2 C157.2 C162.2 C169.2 C174.2 C181.2 C186.2 C193.2 C198.2 C205.2 C210.2 D2.2 F25.2 LED40.1 Q5.1 Q5.2 Q5.3 Q24.5 U1.4 U3.3 U3.5 U3.6 U12.1 U12.4 U17.3 U18.4 U20.4 U22.4 U24.4 U26.4 U28.4 U30.4 U32.4 U34.4 U36.4 U38.4 U40.4 U42.4 U44.4 U46.4 U48.4 U50.4 U52.4 U54.4 U56.4 U58.4 U60.4 U62.4
VCC: C54.1 C62.2 C73.2 U12.2 U17.5

Pads without a net: SCREW1 1; SCREW2 1; SCREW3 1; SCREW4 1; U14 10

## Via types
v1: diameter 0.61, hole 0.305, Top Layer to Bottom Layer, 36 vias

## Routing (per net, layer and track width the routed paths; a pad name or vN(x,y) marks a point on that pad's centre or on a via; arc(x,y) is an arc through that point)
+12V: length 75.4
  Bottom Layer w0.254: -55.61,57.52 -55.81,57.72 -57.57,57.72 ; -49.86,55.38 -50.12,55.13 -55.57,55.13 -55.63,55.18 -55.63,57.38 ; -65.29,60.33 -62.65,60.33 -60.37,62.61 -57.76,62.61 ; -88.84,62.69 -91.24,62.69 -93.58,60.36 -96.38,60.36 ; -96.55,60.29 -96.89,60.63 -98.58,60.63 ; -103.95,57.46 -102.27,57.46 -102.19,57.54 ; -80.71,60.27 -80.47,60.52 -78.18,60.52 -75.98,62.72 -73.48,62.72 ; -65.45,60.28 -65.85,60.68 -67.52,60.68 ; -96.24,55.45 -92.59,55.45 -90.25,57.79 -88.68,57.79 ; -72.97,57.66 -71.21,57.66 -71.14,57.74 ; -88.62,57.62 -86.66,57.62 -86.56,57.51 ; -50,60.35 -50.2,60.55 -51.97,60.55 ; -82.94,60.59 -81.2,60.59 -80.95,60.34 ; -80.78,55.24 -77.37,55.24 -74.94,57.67 -73.07,57.67 ; -65.27,55.52 -61.46,55.52 -59.31,57.67 -57.73,57.67
BAL_SIG: length 10.2
  Bottom Layer w0.254: -69.83,57.52 -68.8,57.52 -68.67,57.64 ; -101.09,60.6 -99.74,60.6 -99.73,60.58 ; -54.57,60.57 -53.33,60.57 -53.15,60.75 ; -84.38,60.56 -84.52,60.7 -85.44,60.7 ; -69.88,60.59 -68.72,60.59 ; -52.98,57.65 -53.09,57.54 -54.43,57.54 ; -99.63,57.68 -99.68,57.63 -100.88,57.63 ; -85.39,57.62 -84.27,57.62
C+: length 108.5
  Inner2 w1: v1(-44.42,30.38) -44.42,30.37 -59.16,30.37 ; v1(-110.04,87.71) v1(-94.62,87.71) ; v1(-79.27,87.7) -94.58,87.7 -94.58,87.71 ; v1(-90.5,30.35) -75.16,30.35 -59.18,30.37 ; -79.28,87.73 -79.22,87.66 v1(-64.07,87.66) ; -75.15,30.35 v1(-75.14,30.35)
  Bottom Layer w1: v1(-75.14,30.35) -77.06,30.35 ; -92.52,30.39 -90.54,30.39 v1(-90.5,30.35) ; v1(-94.62,87.71) -92.68,87.71 ; -108.28,87.73 -110.02,87.73 v1(-110.04,87.71) ; v1(-44.42,30.38) -44.43,30.36 -46.28,30.36 ; v1(-59.17,30.38) -61.58,30.38 -61.61,30.35 ; v1(-79.27,87.7) -79.26,87.72 -77.24,87.72 ; -61.68,87.66 v1(-64.07,87.66)
C-: length 108.8
  Inner2 w1: -78.39,39.11 -78.36,39.08 v1(-63,39.08) ; v1(-75.54,78.53) -60.19,78.53 -60.14,78.58 ; v1(-109.63,39.06) -93.91,39.06 -78.41,39.12 ; v1(-90.97,78.53) -75.54,78.53 ; v1(-60.13,78.57) v1(-44.52,78.57)
  Bottom Layer w1: v1(-90.97,78.53) -90.99,78.51 Q83.1 -92.79,78.51 ; v1(-60.13,78.57) -60.13,78.57 -61.88,78.57 ; v1(-93.87,39.06) -93.86,39.05 -91.72,39.05 ; v1(-44.52,78.57) -46.37,78.57 -46.39,78.59 ; -77.35,78.53 v1(-75.54,78.53) ; -61.01,39.11 -62.96,39.11 v1(-63,39.08) ; -107.5,39.06 v1(-109.63,39.06) ; v1(-78.41,39.12) -76.27,39.12
FU_B5+: length 4.5
  Bottom Layer w1: -62.07,92.38 -61.99,92.46 -61.99,96.81
FU_B6+: length 4.4
  Bottom Layer w1: -77.52,96.81 -77.52,93.16 -78.06,92.62
FU_B7+: length 4.4
  Bottom Layer w1: -93.51,92.48 -93.18,92.81 -93.18,96.78
FU_B9+: length 4.3
  Bottom Layer w1: -92.24,25.59 -92.25,25.57 -92.25,21.26
FU_B10+: length 4.4
  Bottom Layer w1: -76.77,25.6 -76.7,25.53 -76.7,21.25
FU_B11+: length 5.1
  Bottom Layer w0.254: -61.22,25.72 -61.24,25.74 -61.79,25.74
  Bottom Layer w1: -61.09,21.12 -61.09,25.6
$1N48174: length 35.9
  Bottom Layer w0.254: -47.93,68.31 -53.88,68.31 -54.57,67.62 -54.57,66.46
  Bottom Layer w1: -61.32,85.83 -59,85.83 -58.95,85.79 ; -58.9,93.81 -58.9,72.94 -58.78,72.82 ; -58.83,94.08 -58.83,96.79 -59.14,97.11 -60.35,97.11
$1N48175: length 27.5
  Bottom Layer w1: -49.75,80.68 -47.14,80.68 -47.01,80.56 ; -49.78,93.99 -49.78,72.7 -49.9,72.58 ; -46.38,90.49 -49.67,90.49
$1N48180: length 5.7
  Bottom Layer w0.254: -53.32,66.06 -53.32,64.41 -53.39,64.34 -57.23,64.34 -57.3,64.41
$1N48182: length 1.6
  Bottom Layer w0.254: -57.38,66.26 -56.14,66.26 -55.85,65.97
$1N48184: length 1.5
  Bottom Layer w0.254: -49.85,63.47 -49.85,62.11 -49.92,62.04
$1N48185: length 4
  Bottom Layer w0.254: -49.69,66.57 -50.2,66.06 -52.01,66.06 ; -49.69,66.53 -48.26,66.53 -48.22,66.57
$1N48192: length 35.2
  Bottom Layer w0.254: -70.18,66.44 -70.03,66.6 -70.03,67.65 -69.56,68.12 -63.72,68.12 -63.63,68.02
  Bottom Layer w1: -75.93,97.06 -75.04,97.06 -74.42,96.44 -74.42,94.08 ; -74.44,85.67 -74.44,73 ; -74.44,85.67 -74.42,85.69 ; -74.44,85.67 -74.45,85.66 -76.73,85.66 ; -74.44,85.69 -74.44,93.87
$1N48193: length 28.1
  Bottom Layer w1: -62.39,80.84 -65.58,80.84 -65.62,80.88 ; -65.51,72.91 -65.64,73.03 -65.64,93.9 ; -65.49,90.19 -65.33,90.02 -61.78,90.02
$1N48198: length 5.5
  Bottom Layer w0.254: -72.74,64.59 -72.55,64.4 -68.99,64.4 -68.9,64.5 -68.9,65.85 -68.79,65.95
$1N48200: length 1.6
  Bottom Layer w0.254: -71.32,66.11 -72.58,66.11 -72.8,66.33
$1N48202: length 1.2
  Bottom Layer w0.254: -65.47,61.95 -65.51,61.98 -65.51,63.18
$1N48203: length 3.9
  Bottom Layer w0.254: -65.42,66.48 -66.83,66.48 -67.47,65.85 ; -65.27,66.59 -65.18,66.68 -63.73,66.68
$1N48226: length 36.6
  Bottom Layer w0.254: -85.66,66.2 -85.66,67.85 -85.26,68.25 -79.33,68.25 -79.18,68.1
  Bottom Layer w1: -89.75,94.09 -89.75,96.67 -90.26,97.18 -91.34,97.18 ; -92.51,85.75 -89.81,85.75 -89.74,85.82 ; -89.74,85.82 -89.7,85.86 ; -89.74,85.82 -89.74,72.94 -89.68,72.88 ; -89.74,93.87 -89.74,85.86
$1N48227: length 27.6
  Bottom Layer w1: -80.81,80.73 -80.87,80.8 ; -80.81,80.73 -80.75,80.68 -77.81,80.68 ; -80.81,80.73 -80.81,90.35 ; -80.81,80.73 -80.81,72.88 -80.74,72.82 ; -80.81,94.12 -80.81,90.35 ; -80.81,90.35 -77.75,90.35 -77.69,90.29
$1N48232: length 6.1
  Bottom Layer w0.254: -88.43,64.57 -88.03,64.17 -84.39,64.17 -84.26,64.3 -84.26,66
$1N48234: length 1.6
  Bottom Layer w0.254: -86.78,66.11 -88.09,66.11 -88.27,66.29
$1N48236: length 1.5
  Bottom Layer w0.254: -80.76,63.39 -80.76,62.08 -80.92,61.92
$1N48237: length 4.3
  Bottom Layer w0.254: -81.03,66.52 -82.67,66.52 -83.1,66.08 ; -78.97,66.62 -80.9,66.62 -80.95,66.57
$1N48244: length 35.2
  Bottom Layer w0.254: -94.6,68.07 -100.19,68.07 -100.2,68.09 -100.46,68.09 -101,67.55 -101,66.48
  Bottom Layer w1: -105.65,72.88 -105.53,73 -105.53,85.64 ; -105.53,93.87 -105.53,85.89 -105.52,85.89 ; -105.53,85.64 -105.48,85.64 -105.45,85.61 ; -105.53,85.64 -107.63,85.64 ; -106.9,97.19 -106.88,97.21 -105.65,97.21 -105.34,96.9 -105.34,94.13
$1N48245: length 27
  Bottom Layer w1: -93.54,90.17 -96.11,90.17 -96.17,90.23 ; -96.36,93.96 -96.17,93.78 -96.17,90.23 ; -93.17,80.68 -95.99,80.68 -96.11,80.56 ; -96.17,90.23 -96.17,72.66
$1N48250: length 6
  Bottom Layer w0.254: -99.78,65.87 -99.78,64.37 -100.23,63.92 -102.79,63.92 -103.48,64.61 -103.77,64.61
$1N48252: length 1.3
  Bottom Layer w0.254: -102.36,65.94 -102.67,66.25 -103.51,66.25
$1N48254: length 1.6
  Bottom Layer w0.254: -96.36,63.3 -96.36,62.01 -96.55,61.82
$1N48255: length 4.1
  Bottom Layer w0.254: -94.49,66.59 -94.53,66.56 -96.37,66.56 ; -96.43,66.54 -96.83,66.14 -98.45,66.14
$1N48278: length 37.5
  Bottom Layer w0.254: -99.55,52.08 -99.55,50.06 -99.71,49.9 -106.62,49.9
  Bottom Layer w1: -94.07,20.75 -95.16,20.75 -95.45,21.04 -95.45,23.95 ; -95.61,45.4 -95.49,45.28 -95.49,23.98 ; -93.03,32.36 -95.47,32.36
$1N48279: length 28.1
  Bottom Layer w1: -108.16,27.72 -104.52,27.72 -104.46,27.78 ; -104.42,37.17 -104.45,37.14 -107.04,37.14 ; -104.42,37.17 -104.4,37.19 ; -104.42,37.17 -104.42,23.78 ; -104.42,37.17 -104.42,45.48 -104.47,45.52
$1N48284: length 5.8
  Bottom Layer w0.254: -100.85,52.08 -100.85,53.55 -100.53,53.87 -97.4,53.87 -96.88,53.36
$1N48285: length 49.9
  Inner2 w0.254: v1(-109.73,24.96) -108.88,25.81 v1(-99.27,25.81) ; -99.27,25.75 -96.15,22.63 v1(-94.44,22.63)
  Bottom Layer w0.254: -109.06,25.71 -109.73,25.04 v1(-109.73,24.96) ; -93.92,21.96 -94.44,22.49 v1(-94.44,22.63) ; v1(-99.27,25.81) -99.27,46.49 -96.7,49.06 -94.78,49.06 -94.21,49.63 -94.21,52.41 -95.11,53.3
$1N48286: length 1.6
  Bottom Layer w0.254: -98.24,52.02 -97.18,52.02 -96.8,51.64
$1N48287: length 48.9
  Inner2 w0.254: v1(-94.17,29.42) -100.4,29.42 v1(-100.43,29.45)
  Bottom Layer w0.254: v1(-94.17,29.42) -93.82,29.77 -93.82,30.29 ; -95.16,51.44 -95.16,50.17 -95.34,49.99 -97.17,49.99 -100.22,46.95 -107.6,46.95 -108.33,46.22 -108.33,42.79 -106.25,40.71 -106.25,39 ; -100.43,46.93 -100.43,46.92 v1(-100.43,29.45)
$1N48288: length 1.6
  Bottom Layer w0.254: -104.06,56.18 -104.06,54.66 -104.12,54.61
$1N48289: length 4.5
  Bottom Layer w0.254: -106.43,51.26 -104.28,51.26 -104.01,51.53 ; -103.9,51.56 -102.68,51.56 -102.16,52.08
$1N48296: length 53.6
  Bottom Layer w0.254: -84.11,52.02 -84.11,50.2 -84.38,49.93 -91.1,49.93 ; -84.17,52.28 -84.06,52.28 -83.06,53.29 -82.48,53.29 -81.48,52.3 -81,52.3 -80.4,52.9 -80.4,53.91 -80.23,54.08 -79.22,54.08 -79.12,54.18 -78.86,54.18 -78.2,53.52 -78.2,50.48 -78.25,50.44 -78.25,45.59
  Bottom Layer w1: -79.87,32.34 -79.81,32.28 -77.48,32.28 ; -79.95,45.43 -79.92,45.4 -79.92,24.08 ; -79.92,24.01 -79.92,21.04 -79.6,20.73 -78.56,20.73
$1N48297: length 27.8
  Bottom Layer w1: -89.03,27.87 -89.08,27.81 -92.73,27.81 ; -88.96,23.93 -88.96,45.41 -88.9,45.47 ; -89.09,37.22 -89.14,37.17 -91.62,37.17
$1N48302: length 6.6
  Bottom Layer w0.254: -81.31,53.63 -82.04,54.36 -85.18,54.36 -85.36,54.18 -85.36,53.92 -85.3,53.87 -85.3,52.05
$1N48303: length 49.1
  Inner2 w0.254: v1(-78.52,22.7) -80.84,22.7 -83.96,25.83 ; v1(-83.97,25.86) -93.87,25.86 v1(-94.37,25.36)
  Bottom Layer w0.254: v1(-94.37,25.36) -93.88,25.36 -93.53,25.72 ; v1(-78.52,22.7) -78.52,22.12 -78.51,22.11 ; v1(-83.97,25.86) -83.97,45.22 -78.56,50.63 -78.56,52.37 -79.54,53.35
$1N48304: length 1.7
  Bottom Layer w0.254: -81.29,51.6 -81.67,51.98 -82.79,51.98
$1N48305: length 47.5
  Inner2 w0.254: v1(-85.01,29.31) -78.7,29.31 v1(-78.67,29.34)
  Bottom Layer w0.254: v1(-85.01,29.31) -85.01,46.83 ; -85.01,46.83 -91.93,46.83 -92.11,46.65 -92.11,42.36 -90.67,40.91 -90.67,39.32 ; -85.01,46.83 -84.63,46.83 -79.76,51.7 ; -85.01,46.83 -85.01,46.85 ; v1(-78.67,29.34) -78.26,29.75 -78.26,30.37
$1N48306: length 1.3
  Bottom Layer w0.254: -88.7,56.02 -88.7,54.71 -88.73,54.69
$1N48307: length 4.7
  Bottom Layer w0.254: -91.1,51.34 -87.18,51.34 ; -86.61,51.97 -87.18,51.4
$1N48330: length 55.1
  Bottom Layer w0.254: -75.52,49.94 -68.63,49.94 -68.58,49.99 -68.58,51.99 ; -63.15,45.17 -63.15,46.63 -63.18,46.66 -63.18,53.56 -63.7,54.08 -64.73,54.08 -64.9,53.91 -64.9,51.04 -65.25,50.69 -67.56,50.69 -67.89,51.03 -67.89,51.37 -68.4,51.88
  Bottom Layer w1: -64.43,24.02 -64.43,32.32 ; -64.43,32.32 -64.42,32.31 -61.89,32.31 ; -64.43,32.32 -64.43,34.73 ; -64.43,32.32 -64.48,32.37 ; -64.43,34.73 -64.43,45.16 -64.54,45.27 ; -64.43,34.73 -64.49,34.73 ; -63.08,20.71 -64.29,20.71 -64.5,20.92 -64.5,23.99
$1N48331: length 27.2
  Bottom Layer w1: -73.5,45.43 -73.56,45.36 -73.56,24.15 ; -73.63,27.79 -73.66,27.77 -77.06,27.77 ; -76.09,37.41 -73.67,37.41
$1N48336: length 5.6
  Bottom Layer w0.254: -65.71,53.2 -66.25,53.73 -69.23,53.73 -69.81,53.15 -69.81,52.14
$1N48337: length 48.6
  Inner2 w0.254: v1(-78.81,25.52) -78.41,25.91 -68.67,25.91 ; v1(-63.12,22.69) -65.48,22.69 v1(-68.69,25.89)
  Bottom Layer w0.254: v1(-68.69,25.89) -68.65,25.93 -68.61,45.31 -63.94,49.97 -63.94,50.17 -63.85,50.26 -63.85,50.72 -63.53,51.04 -63.53,52.14 -63.94,52.55 -63.94,53.29 -63.95,53.29 -63.95,53.45 ; -62.93,22.03 -62.93,22.49 v1(-63.12,22.69) ; -78.09,25.73 -78.3,25.52 v1(-78.81,25.52)
$1N48338: length 1.7
  Bottom Layer w0.254: -67.32,51.98 -66.2,51.98 -65.81,51.59
$1N48339: length 49.4
  Inner2 w0.254: v1(-63.36,29.06) -63.65,28.78 v1(-69.3,28.78)
  Bottom Layer w0.254: -67.63,47 -76.23,47 -76.43,46.8 -76.43,41.66 -75.29,40.51 -75.29,39.29 -75.17,39.17 ; -67.63,47 -64.21,50.41 ; -67.63,47 -69.3,45.33 v1(-69.3,28.78) ; v1(-63.36,29.06) -62.87,29.55 -62.87,30.29 ; -64.21,51.52 -64.21,50.41
$1N48340: length 1.3
  Bottom Layer w0.254: -72.92,56.04 -72.92,54.95 -73.09,54.78
$1N48341: length 4.6
  Bottom Layer w0.254: -73.14,51.49 -73.36,51.27 -75.56,51.27 ; -71.17,52.04 -72.41,52.04 -73.02,51.43
$1N48348: length 56.6
  Bottom Layer w0.254: -53.14,51.66 -53.24,51.76 ; -53.14,51.66 -53.14,50.11 -53.38,49.87 -60.1,49.87 ; -53.14,51.66 -52.06,50.58 -49.4,50.58 -49.4,53.91 -49.23,54.08 -48.2,54.08 -47.12,53 -47.12,45.79 -47.54,45.37 -48.86,45.37
  Bottom Layer w1: -47.58,20.76 -47.59,20.75 -48.72,20.75 -49.01,21.04 -49.01,23.95 ; -48.99,23.99 -48.99,32.45 ; -48.99,32.45 -49,32.45 ; -48.99,32.45 -48.99,45.42 ; -48.99,32.45 -46.47,32.45
$1N48349: length 28.2
  Bottom Layer w1: -57.82,27.8 -57.85,27.77 -61.37,27.77 ; -57.97,45.46 -57.76,45.25 -57.76,23.79 ; -60.61,37.45 -57.89,37.45 -57.81,37.53
$1N48354: length 5.4
  Bottom Layer w0.254: -54.36,52.14 -54.36,53.19 -53.96,53.59 -50.42,53.59 -50.23,53.39
$1N48355: length 48.8
  Inner2 w0.254: -52.28,25.92 -63.07,25.92 v1(-63.36,25.63) ; -47.79,22.71 -49.04,22.71 -52.29,25.96
  Bottom Layer w0.254: -47.46,21.97 -47.46,22.42 -47.79,22.75 ; -48.65,53.49 -47.87,52.71 -47.71,52.71 -47.53,52.53 -47.53,50.4 -52.28,45.65 v1(-52.28,25.91) ; v1(-63.36,25.63) -62.71,25.63 -62.64,25.71
  vias: v1(-47.77,22.72)
$1N48356: length 1.5
  Bottom Layer w0.254: -51.86,51.94 -50.77,51.94 -50.44,51.61
$1N48357: length 48.6
  Inner2 w0.254: v1(-47.63,28.98) -48.1,28.51 v1(-52.9,28.51)
  Bottom Layer w0.254: -48.67,51.43 -48.67,50.81 -49.04,50.43 ; -52.97,46.51 -53.09,46.39 -53.09,29.1 -52.9,28.91 v1(-52.9,28.51) ; -52.97,46.51 -60.47,46.51 -60.65,46.33 -60.65,40.79 -59.55,39.68 -59.55,39.32 -59.71,39.16 -59.79,39.16 ; -52.97,46.51 -49.04,50.43 ; -49.04,50.43 -49.04,50.47 -48.79,50.72 -48.79,51.44 -48.63,51.6 ; v1(-47.63,28.98) -47.63,30.11 -47.37,30.36
$1N48358: length 1.4
  Bottom Layer w0.254: -57.48,56.14 -57.48,54.86 -57.57,54.77
$1N48359: length 5
  Bottom Layer w0.254: -57.8,51.39 -56.23,51.39 -55.54,52.08 ; -60.12,51.32 -57.89,51.32 ; -57.81,51.4 -57.64,51.57

## Copper pours and planes (outline as drawn; the poured copper is in the pictures)
GND on Top Layer: -0.13,99.87 149.87,99.87 149.87,-0.13 -0.13,-0.13
GND on Bottom Layer: 0,100 150,100 150,0 0,0
